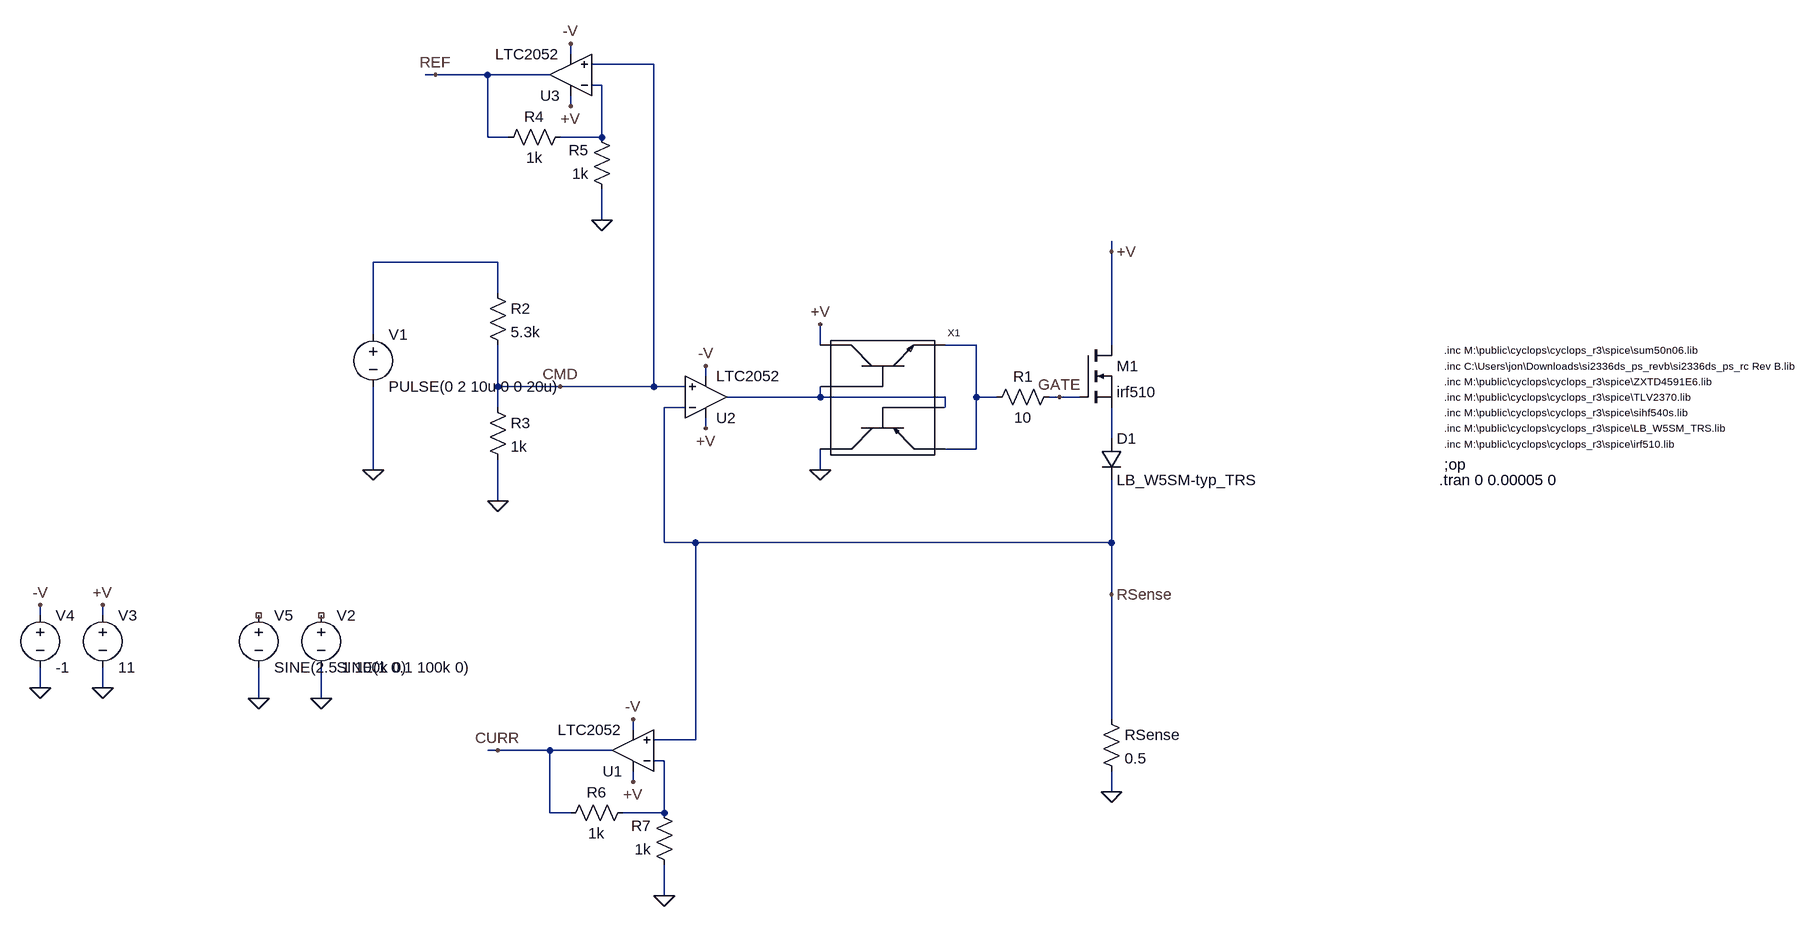
[diagram p0: schematic cyclops_r3.3.asc]
cyclops_r3.3.asc, the LTspice schematic file:
Version 4
SHEET 1 1460 980
WIRE -672 -352 -672 -368
WIRE -544 -336 -640 -336
WIRE -880 -320 -896 -320
WIRE -800 -320 -880 -320
WIRE -704 -320 -800 -320
WIRE -624 -304 -640 -304
WIRE -672 -272 -672 -288
WIRE -800 -224 -800 -320
WIRE -768 -224 -800 -224
WIRE -624 -224 -624 -304
WIRE -624 -224 -688 -224
WIRE -624 -96 -624 -144
WIRE 160 -48 160 -64
WIRE -784 -32 -976 -32
WIRE -784 16 -784 -32
WIRE -976 80 -976 -32
WIRE -288 96 -288 64
WIRE -48 96 -96 96
WIRE 160 96 160 -48
WIRE -464 144 -464 128
WIRE -784 160 -784 96
WIRE -688 160 -784 160
WIRE -544 160 -544 -336
WIRE -544 160 -688 160
WIRE -496 160 -544 160
WIRE -288 176 -288 160
WIRE -288 176 -432 176
WIRE -96 176 -288 176
WIRE -48 176 -48 96
WIRE -16 176 -48 176
WIRE 80 176 64 176
WIRE 112 176 80 176
WIRE -784 192 -784 160
WIRE -496 192 -528 192
WIRE -96 192 -96 176
WIRE -464 224 -464 208
WIRE 160 240 160 192
WIRE -48 256 -48 176
WIRE -48 256 -96 256
WIRE -976 288 -976 160
WIRE -288 288 -288 256
WIRE -784 336 -784 272
WIRE -528 400 -528 192
WIRE -480 400 -528 400
WIRE 160 400 160 304
WIRE 160 400 -480 400
WIRE 160 480 160 400
WIRE -1488 512 -1488 496
WIRE -1392 512 -1392 496
WIRE -1488 624 -1488 592
WIRE -1392 624 -1392 592
WIRE -1152 640 -1152 592
WIRE -1056 640 -1056 592
WIRE 160 672 160 480
WIRE -576 688 -576 672
WIRE -480 704 -480 400
WIRE -480 704 -544 704
WIRE -784 720 -800 720
WIRE -704 720 -784 720
WIRE -608 720 -704 720
WIRE -528 736 -544 736
WIRE -576 768 -576 752
WIRE 160 784 160 752
WIRE -704 816 -704 720
WIRE -672 816 -704 816
WIRE -528 816 -528 736
WIRE -528 816 -592 816
WIRE -528 944 -528 896
FLAG 160 784 0
FLAG -976 288 0
FLAG 160 480 RSense
FLAG -1392 624 0
FLAG -1392 496 +V
FLAG -1488 624 0
FLAG -1488 496 -V
FLAG 160 -48 +V
FLAG -288 64 +V
FLAG -288 288 0
FLAG -464 128 -V
FLAG -464 224 +V
FLAG 80 176 GATE
FLAG -688 160 CMD
FLAG -1056 640 0
FLAG -1152 640 0
FLAG -880 -320 REF
FLAG -624 -96 0
FLAG -672 -368 -V
FLAG -672 -272 +V
FLAG -784 720 CURR
FLAG -528 944 0
FLAG -576 672 -V
FLAG -576 768 +V
FLAG -784 336 0
SYMBOL nmos 112 96 R0
SYMATTR InstName M1
SYMATTR Value irf510
SYMATTR Prefix X
SYMBOL res 144 656 R0
SYMATTR InstName RSense
SYMATTR Value 0.5
SYMATTR SpiceLine pwr=20
SYMBOL voltage -976 64 R0
WINDOW 123 0 0 Left 2
WINDOW 39 0 0 Left 2
SYMATTR InstName V1
SYMATTR Value PULSE(0 2 10u 0 0 20u)
SYMBOL voltage -1392 496 R0
WINDOW 123 0 0 Left 2
WINDOW 39 0 0 Left 2
SYMATTR InstName V3
SYMATTR Value 11
SYMBOL voltage -1488 496 R0
WINDOW 123 0 0 Left 2
WINDOW 39 0 0 Left 2
SYMATTR InstName V4
SYMATTR Value -1
SYMBOL diode 144 240 R0
SYMATTR InstName D1
SYMATTR Value LB_W5SM-typ_TRS
SYMBOL ZXTD45 -192 176 R0
SYMATTR InstName X1
SYMATTR Prefix X
SYMATTR Value ZXTD4591E6
SYMBOL res 80 160 R90
WINDOW 0 0 56 VBottom 2
WINDOW 3 32 56 VTop 2
SYMATTR InstName R1
SYMATTR Value 10
SYMBOL Opamps\\LTC2052 -464 176 M180
SYMATTR InstName U2
SYMBOL voltage -1056 496 R0
WINDOW 123 0 0 Left 2
WINDOW 39 0 0 Left 2
SYMATTR InstName V2
SYMATTR Value SINE(1 0.1 100k 0)
SYMBOL res -800 0 R0
SYMATTR InstName R2
SYMATTR Value 5.3k
SYMBOL res -800 176 R0
SYMATTR InstName R3
SYMATTR Value 1k
SYMBOL voltage -1152 496 R0
WINDOW 123 0 0 Left 2
WINDOW 39 0 0 Left 2
SYMATTR InstName V5
SYMATTR Value SINE(2.5 1 100k 0)
SYMBOL Opamps\\LTC2052 -672 -320 R180
SYMATTR InstName U3
SYMBOL res -672 -240 R90
WINDOW 0 0 56 VBottom 2
WINDOW 3 32 56 VTop 2
SYMATTR InstName R4
SYMATTR Value 1k
SYMBOL res -608 -128 R180
WINDOW 0 36 76 Left 2
WINDOW 3 36 40 Left 2
SYMATTR InstName R5
SYMATTR Value 1k
SYMBOL Opamps\\LTC2052 -576 720 R180
SYMATTR InstName U1
SYMBOL res -576 800 R90
WINDOW 0 0 56 VBottom 2
WINDOW 3 32 56 VTop 2
SYMATTR InstName R6
SYMATTR Value 1k
SYMBOL res -512 912 R180
WINDOW 0 36 76 Left 2
WINDOW 3 36 40 Left 2
SYMATTR InstName R7
SYMATTR Value 1k
TEXT 672 200 Left 1 !.inc M:\\public\\cyclops\\cyclops_r3\\spice\\sihf540s.lib
TEXT 672 280 Left 2 !;op
TEXT 672 224 Left 1 !.inc M:\\public\\cyclops\\cyclops_r3\\spice\\LB_W5SM_TRS.lib
TEXT 664 304 Left 2 !.tran 0 0.00005 0
TEXT 672 176 Left 1 !.inc M:\\public\\cyclops\\cyclops_r3\\spice\\TLV2370.lib
TEXT 672 152 Left 1 !.inc M:\\public\\cyclops\\cyclops_r3\\spice\\ZXTD4591E6.lib
TEXT 672 248 Left 1 !.inc M:\\public\\cyclops\\cyclops_r3\\spice\\irf510.lib
TEXT 672 128 Left 1 !.inc C:\\Users\\jon\\Downloads\\si2336ds_ps_revb\\si2336ds_ps_rc Rev B.lib
TEXT 672 104 Left 1 !.inc M:\\public\\cyclops\\cyclops_r3\\spice\\sum50n06.lib

The netlist it stands for:
* cyclops_r3.3.asc
XM1 +V GATE N005 irf510  ; pins D G S
RSense RSense 0 0.5 pwr=20
V1 N002 0 PULSE(0 2 10u 0 0 20u)
V3 +V 0 11
V4 -V 0 -1
D1 N005 RSense LB_W5SM-typ_TRS
XX1 +V N004 0 N003 N004 N003 ZXTD45 params: ZXTD4591E6  ; pins C1 B1 C2 E2 B2 E1
R1 GATE N003 10
* U2: LTC2052 (symbol Opamps\LTC2052 not available, pins judged from their places): In+=CMD In-=RSense V+=+V V-=-V OUT=N004
V2 NC_01 0 SINE(1 0.1 100k 0)
R2 N002 CMD 5.3k
R3 CMD 0 1k
V5 NC_02 0 SINE(2.5 1 100k 0)
* U3: LTC2052 (symbol Opamps\LTC2052 not available, pins judged from their places): In+=CMD In-=N001 V+=+V V-=-V OUT=REF
R4 N001 REF 1k
R5 0 N001 1k
* U1: LTC2052 (symbol Opamps\LTC2052 not available, pins judged from their places): In+=RSense In-=N006 V+=+V V-=-V OUT=CURR
R6 N006 CURR 1k
R7 0 N006 1k
.model D D
.lib standard.dio
.inc M:\public\cyclops\cyclops_r3\spice\sihf540s.lib
;op
.inc M:\public\cyclops\cyclops_r3\spice\LB_W5SM_TRS.lib
.tran 0 0.00005 0
.inc M:\public\cyclops\cyclops_r3\spice\TLV2370.lib
.inc M:\public\cyclops\cyclops_r3\spice\ZXTD4591E6.lib
.inc M:\public\cyclops\cyclops_r3\spice\irf510.lib
.inc C:\Users\jon\Downloads\si2336ds_ps_revb\si2336ds_ps_rc Rev B.lib
.inc M:\public\cyclops\cyclops_r3\spice\sum50n06.lib
.backanno
.end